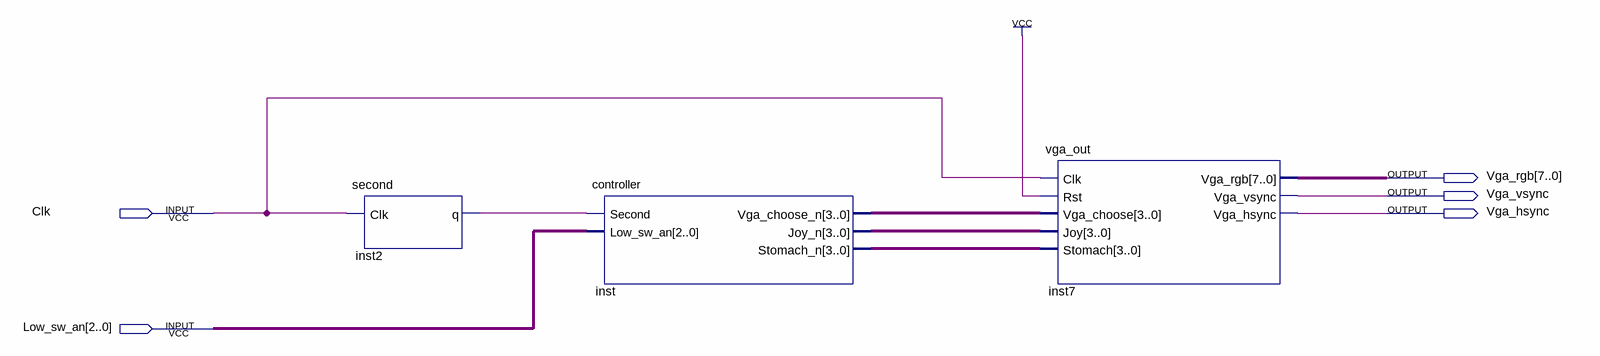
[diagram p0: schematic sheet]
// Quartus schematic digimon.bdf as structural Verilog: 3 symbols, 5 pins
module digimon (
  input  Clk,
  input  [2:0] Low_sw_an,
  output [7:0] Vga_rgb,
  output Vga_vsync,
  output Vga_hsync
);

  wire inst2_q;
  wire [3:0] inst_joy_n, inst_stomach_n, inst_vga_choose_n;

  second inst2 (.Clk(Clk), .q(inst2_q));
  controller inst (
    .Second(inst2_q), .Low_sw_an(Low_sw_an), .Vga_choose_n(inst_vga_choose_n), .Joy_n(inst_joy_n),
    .Stomach_n(inst_stomach_n));
  vga_out inst7 (
    .Clk(Clk), .Rst(1'b1), .Vga_choose(inst_vga_choose_n), .Joy(inst_joy_n), .Stomach(inst_stomach_n),
    .Vga_rgb(Vga_rgb), .Vga_vsync(Vga_vsync), .Vga_hsync(Vga_hsync));
endmodule
